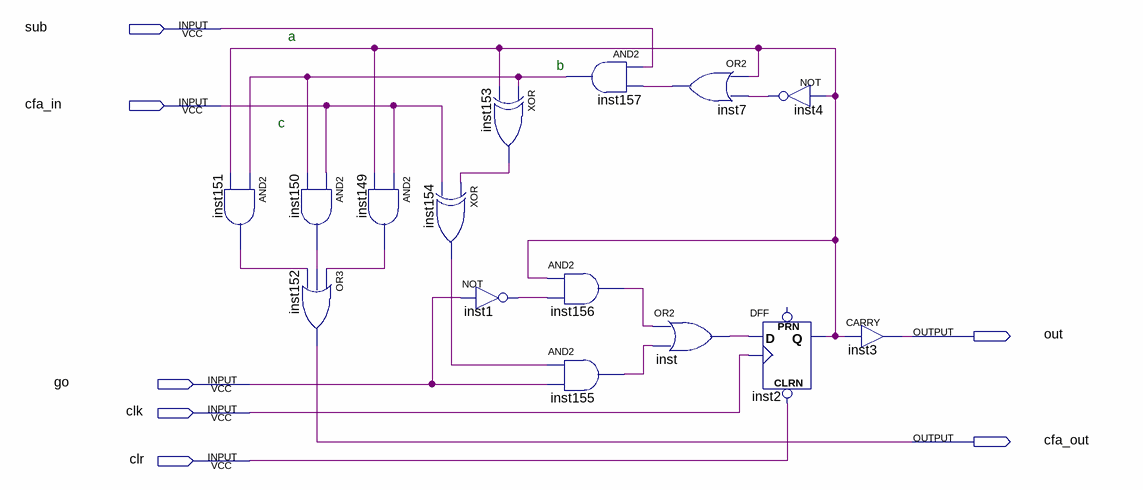
[diagram p0: schematic sheet]
// Quartus schematic counte.bdf as structural Verilog: 15 symbols, 7 pins
module counte (
  input  sub,
  input  cfa_in,
  input  go,
  input  clk,
  input  clr,
  output out,
  output cfa_out
);

  wire inst1_out, inst2_q, inst4_out, inst7_out, inst149_out, inst150_out, inst151_out, inst153_out,
       inst154_out, inst155_out, inst156_out, inst157_out, inst_out;

  and inst151 (inst151_out, inst157_out, inst2_q);
  and inst150 (inst150_out, cfa_in, inst157_out);
  or inst152 (cfa_out, inst149_out, inst150_out, inst151_out);
  and inst149 (inst149_out, cfa_in, inst2_q);
  xor inst154 (inst154_out, inst153_out, cfa_in);
  not inst1 (inst1_out, go);
  xor inst153 (inst153_out, inst157_out, inst2_q);
  and inst157 (inst157_out, sub, inst7_out);
  and inst156 (inst156_out, inst2_q, inst1_out);
  and inst155 (inst155_out, inst154_out, go);
  or inst7 (inst7_out, inst2_q, inst4_out);
  or inst (inst_out, inst156_out, inst155_out);
  not inst4 (inst4_out, inst2_q);
  DFF inst2 (.CLRN(clr), .CLK(clk), .D(inst_out), .Q(inst2_q));  // open: PRN
  CARRY inst3 (.IN(inst2_q), .OUT(out));

  // Notes on the sheet:
  //   a
  //   b
  //   c
endmodule
